# EAGLE design Purpletooth_Jambot (EAGLE 6.4)

## Sheet 1 of 3: Power and data ports
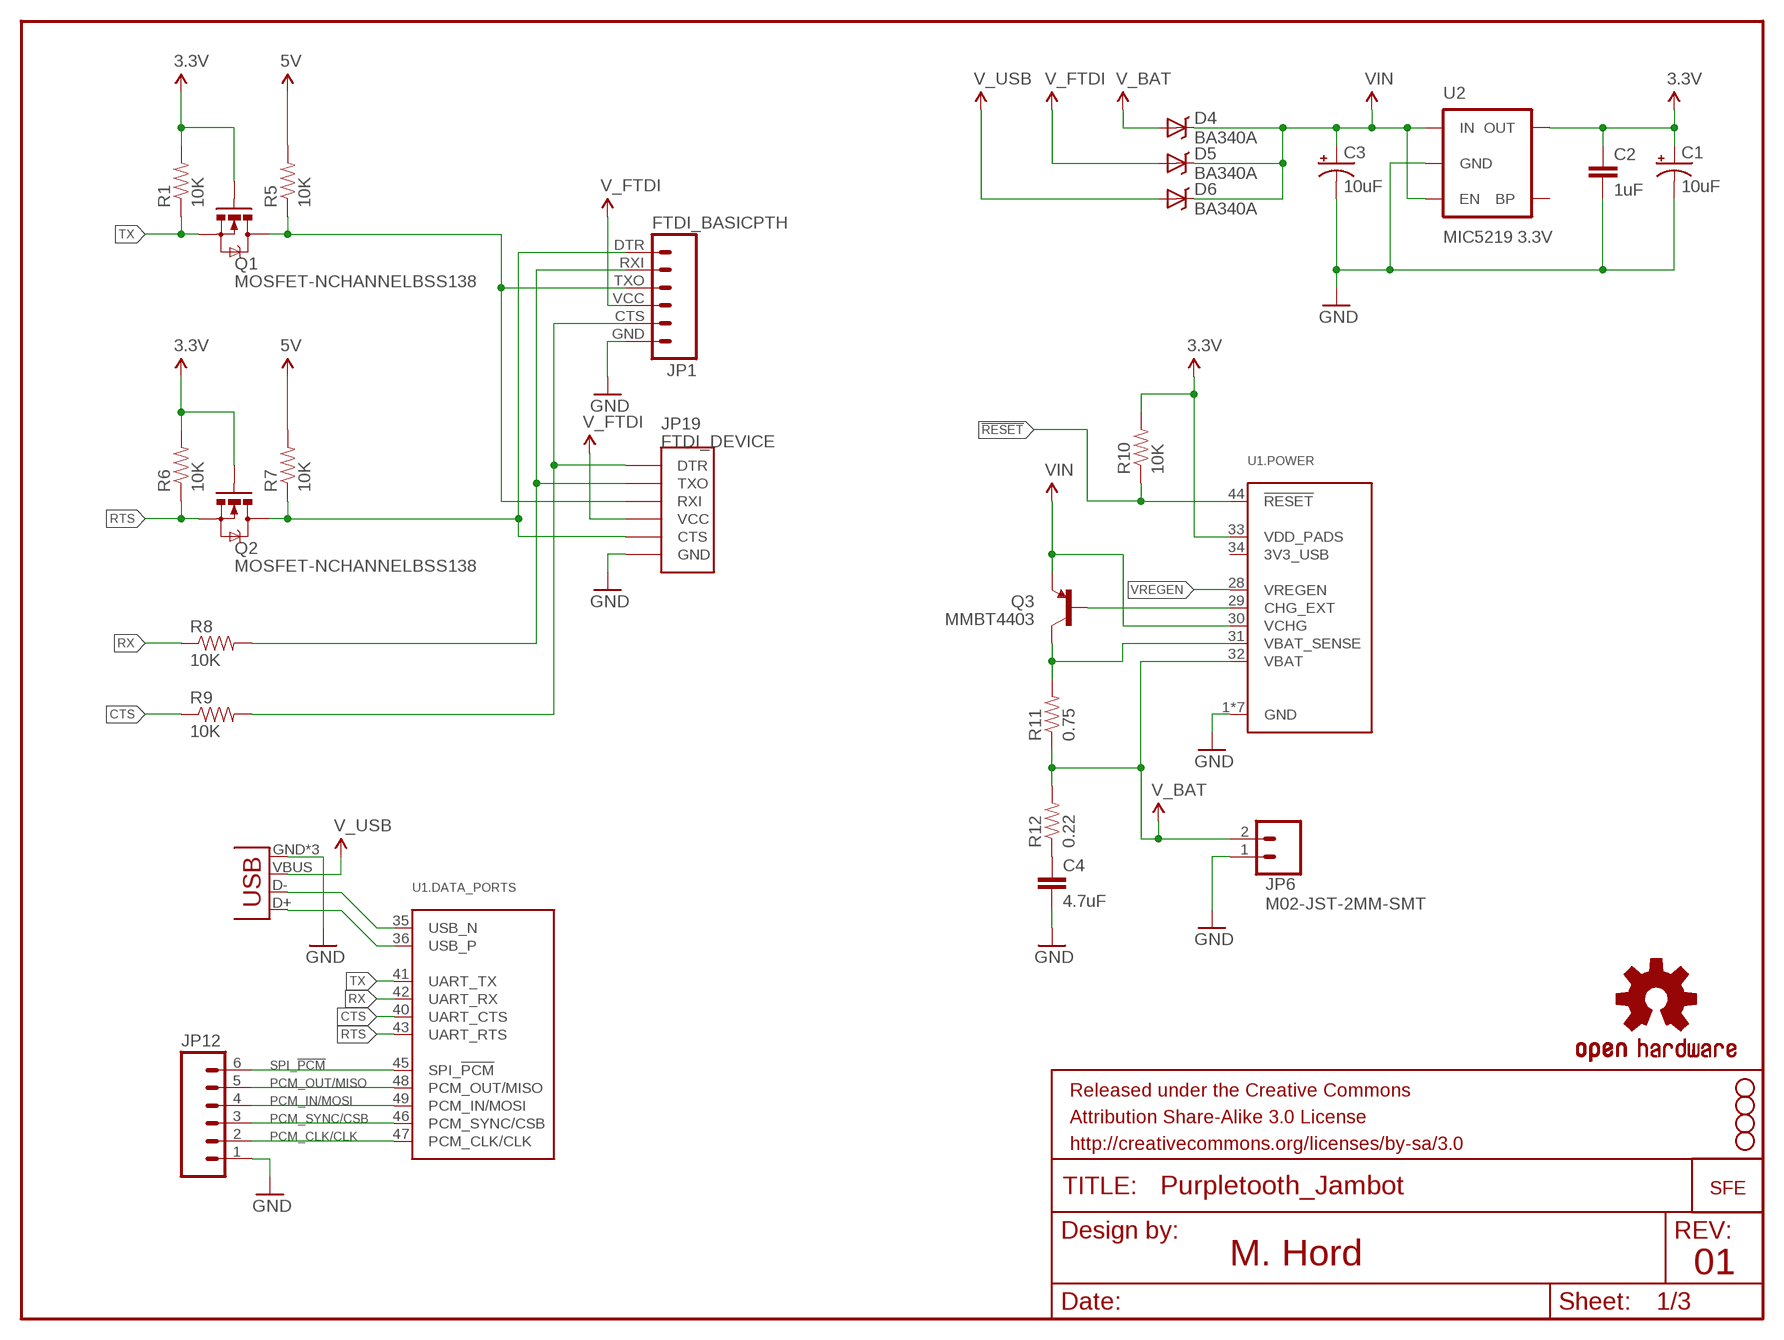
[diagram p0: schematic, sheet 1]

### Parts
C1  10uF  10UF-16V-10%(TANT)  [EIA3216]
C2  1uF  1UF-25V-10%(0805)  [0805]
C3  10uF  10UF-16V-10%(TANT)  [EIA3216]
C4  4.7uF  4.7UF-6.3V-10%(0603)0603  [0603-CAP]
D4  BA340A  B340A  [SMA-DIODE]
D5  BA340A  B340A  [SMA-DIODE]
D6  BA340A  B340A  [SMA-DIODE]
FRAME1  FRAME-LETTER  [CREATIVE_COMMONS]
JP1  FTDI_BASICPTH  [FTDI_BASIC]
JP2  USB-MICROB  [USB-MICROB]
JP6  M02-JST-2MM-SMT  [JST-2-SMD]
JP12  M06SIP  [1X06]
JP19  FTDI_DEVICE  [FTDI_DEVICE_SIDE]
LOGO1  OSHW-LOGOM  [OSHW-LOGO-M]
LOGO2  LOGO-SFENEW  [SFE-NEW-WEBLOGO]
Q1  MOSFET-NCHANNELBSS138  [SOT23]
Q2  MOSFET-NCHANNELBSS138  [SOT23]
Q3  MMBT4403  TRANSISTOR_PNPMMBT4403  [SOT23]
R1  10K  10KOHM1/10W1%(0603)0603  [0603-RES]
R5  10K  10KOHM1/10W1%(0603)0603  [0603-RES]
R6  10K  10KOHM1/10W1%(0603)0603  [0603-RES]
R7  10K  10KOHM1/10W1%(0603)0603  [0603-RES]
R8  10K  10KOHM1/10W1%(0603)0603  [0603-RES]
R9  10K  10KOHM1/10W1%(0603)0603  [0603-RES]
R10  10K  10KOHM1/10W1%(0603)0603  [0603-RES]
R11  0.75  0.75OHM1/4W1%(0805)  [0805]
R12  0.22  0.22OHM1/4W1%(0805)  [0805]
STANDOFF1  STAND-OFF  [STAND-OFF]
STANDOFF2  STAND-OFF  [STAND-OFF]
STANDOFF3  STAND-OFF  [STAND-OFF]
STANDOFF4  STAND-OFF  [STAND-OFF]
U1  BC127  [BC127]
U2  MIC5219 3.3V  V_REG_MIC52193.3V  [SOT23-5]

### Nets
3.3V: C1.A(+) C2.1 Q1.1(G) Q2.1(G) R1.2 R6.2 R10.2 U1.33(.POWER:VDD_PADS) U2.5(OUT) ; also sheet 2,3
5V_CTS: JP1.CTS JP19.P$1(DTR) R9.2
5V_RTS: JP1.DTR JP19.P$5(CTS) Q2.3(D) R7.1
5V_RX: JP1.RXI JP19.P$2(TXO) R8.2
5V_TX: JP1.TXO JP19.P$3(RXI) Q1.3(D) R5.1
!RESET: R10.1 U1.44(.POWER:!RESET)
CHG_EXT: Q3.1(B) U1.29(.POWER:CHG_EXT)
CTS: R9.1 U1.40(.DATA_PORTS:UART_CTS)
GND: C1.C(-) C2.2 C3.C(-) C4.2 JP1.GND JP2.GND JP2.MT1(GND) JP2.MT2(GND) JP6.1 JP12.1 JP19.P$6(GND) U1.1(.POWER:GND) U1.2(.POWER:GND) U1.3(.POWER:GND) U1.4(.POWER:GND) U1.11(.POWER:GND) U1.22(.POWER:GND) U1.27(.POWER:GND) U2.2(GND) ; also sheet 2,3
N$28: C4.1 R12.1
PCM_CLK/CLK: JP12.2 U1.47(.DATA_PORTS:PCM_CLK/CLK)
PCM_IN/MOSI: JP12.4 U1.49(.DATA_PORTS:PCM_IN/MOSI)
PCM_OUT/MISO: JP12.5 U1.48(.DATA_PORTS:PCM_OUT/MISO)
PCM_SYNC/CSB: JP12.3 U1.46(.DATA_PORTS:PCM_SYNC/CSB)
RTS: Q2.2(S) R6.1 U1.43(.DATA_PORTS:UART_RTS)
RX: R8.1 U1.42(.DATA_PORTS:UART_RX)
SPI_!PCM: JP12.6 U1.45(.DATA_PORTS:SPI_!PCM)
TX: Q1.2(S) R1.1 U1.41(.DATA_PORTS:UART_TX)
USB_N: JP2.D- U1.35(.DATA_PORTS:USB_N)
USB_P: JP2.D+ U1.36(.DATA_PORTS:USB_P)
V_BAT: D4.A JP6.2 R11.1 R12.2 U1.32(.POWER:VBAT)
V_FTDI: D5.A JP1.VCC JP19.P$4(VCC)
V_USB: D6.A JP2.VBUS
VBAT_SENSE: Q3.3(C) R11.2 U1.31(.POWER:VBAT_SENSE)
VIN: C3.A(+) D4.C D5.C D6.C Q3.2(E) R5.2 R7.2 U1.30(.POWER:VCHG) U2.1(IN) U2.3(EN) ; supply symbol labelled 5V
VREGEN: U1.28(.POWER:VREGEN) ; also sheet 3
Unconnected: U1.34(.POWER:3V3_USB) U2.4(BP)

### Notes on the sheet
- M. Hord | 01

## Sheet 2 of 3: Analog audio section
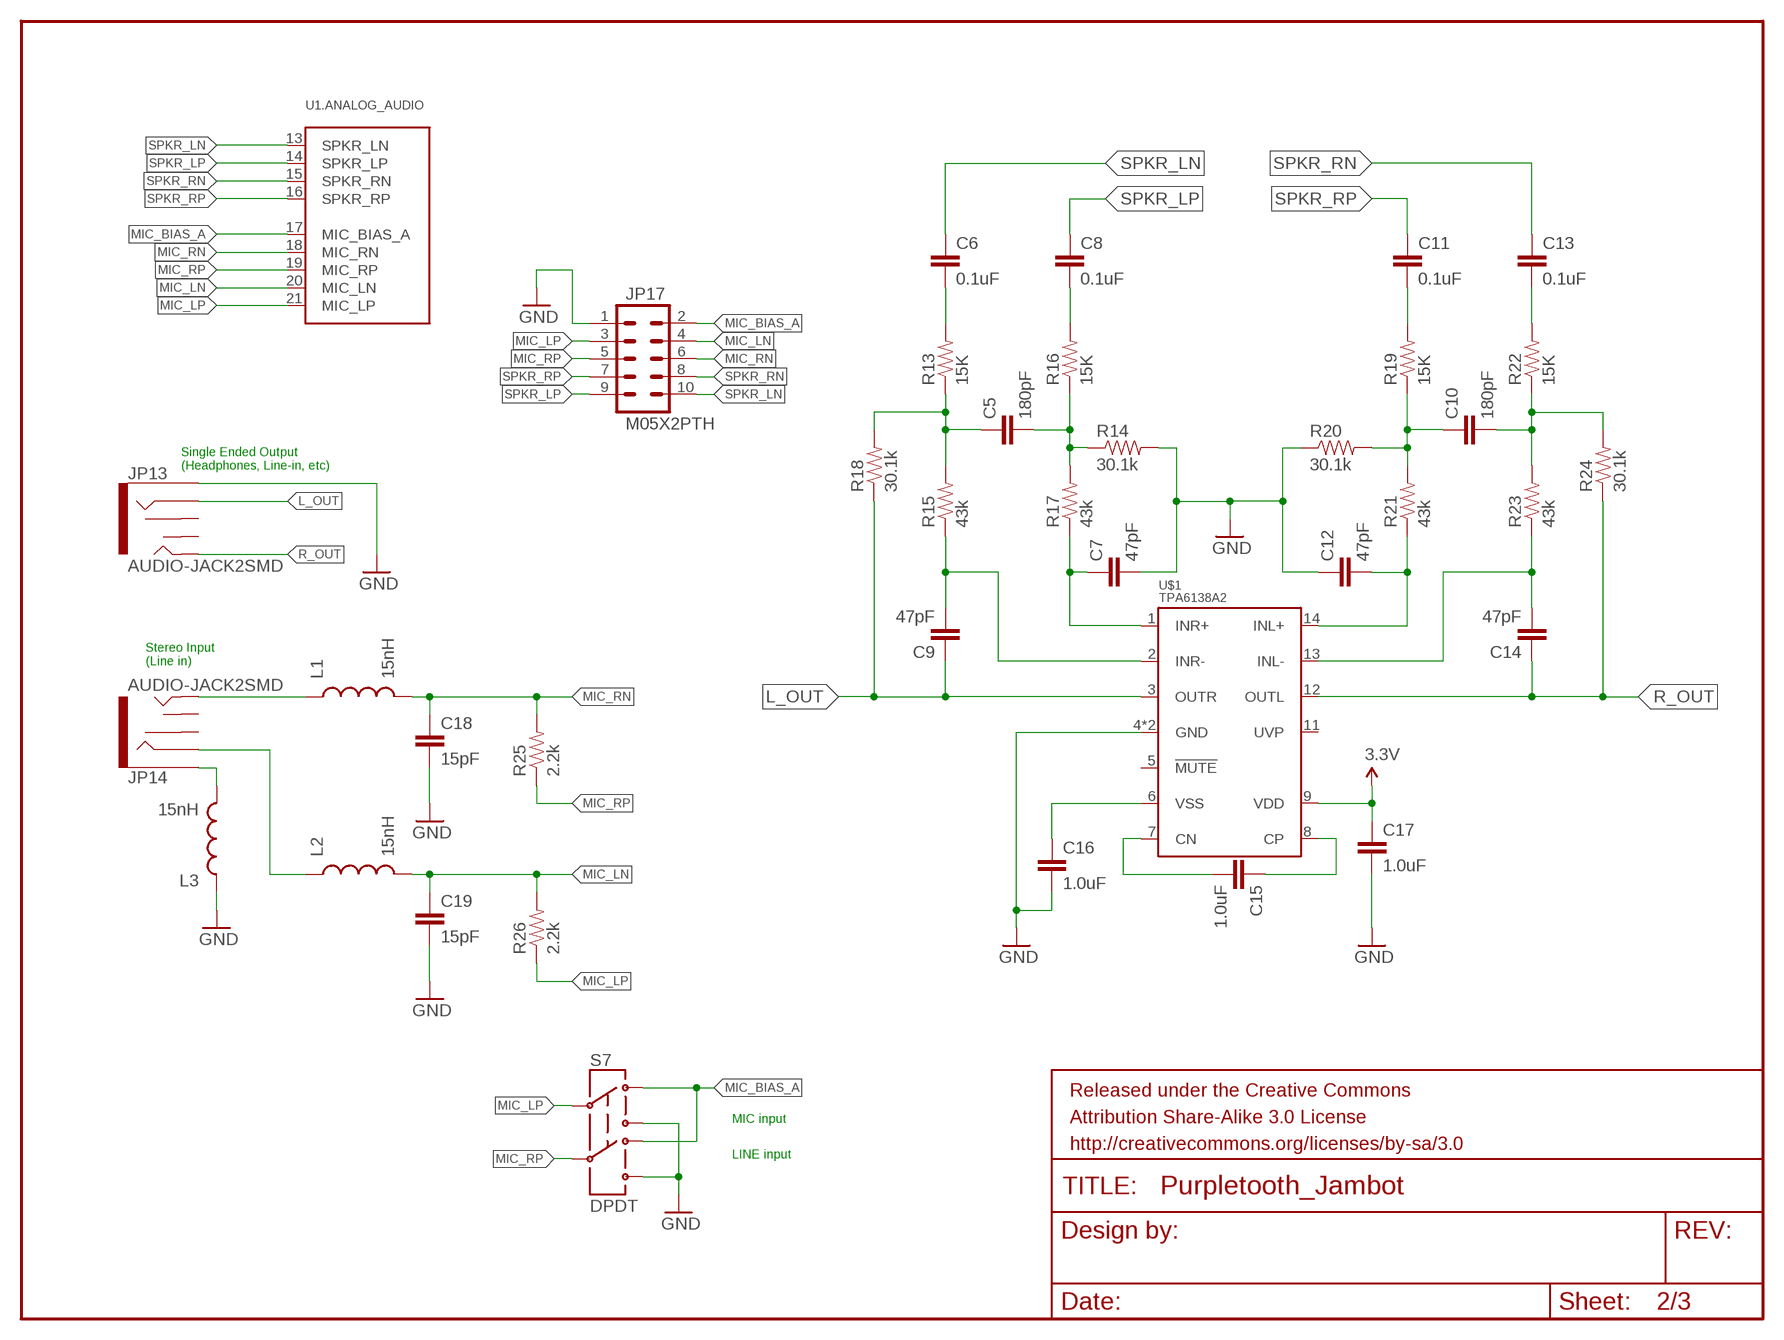
[diagram p1: schematic, sheet 2]

### Parts
C5  180pF  CAP0603-CAP  [0603-CAP]
C6  0.1uF  0.1UF-25V-5%(0603)  [0603-CAP]
C7  47pF  47PF-50V-5%(0603)  [0603-CAP]
C8  0.1uF  0.1UF-25V-5%(0603)  [0603-CAP]
C9  47pF  47PF-50V-5%(0603)  [0603-CAP]
C10  180pF  CAP0603-CAP  [0603-CAP]
C11  0.1uF  0.1UF-25V-5%(0603)  [0603-CAP]
C12  47pF  47PF-50V-5%(0603)  [0603-CAP]
C13  0.1uF  0.1UF-25V-5%(0603)  [0603-CAP]
C14  47pF  47PF-50V-5%(0603)  [0603-CAP]
C15  1.0uF  1.0UF-16V-10%(0603)  [0603-CAP]
C16  1.0uF  1.0UF-16V-10%(0603)  [0603-CAP]
C17  1.0uF  1.0UF-16V-10%(0603)  [0603-CAP]
C18  15pF  15PF-50V-5%(0603)  [0603-CAP]
C19  15pF  15PF-50V-5%(0603)  [0603-CAP]
FRAME2  FRAME-LETTER  [CREATIVE_COMMONS]
JP13  AUDIO-JACK2SMD  [AUDIO-JACK-3.5MM-SMD]
JP14  AUDIO-JACK2SMD  [AUDIO-JACK-3.5MM-SMD]
JP17  M05X2PTH  [AVR_ICSP]
L1  15nH  INDUCTOR0603  [0603]
L2  15nH  INDUCTOR0603  [0603]
L3  15nH  INDUCTOR0603  [0603]
R13  15K  15KOHM1/10W1%(0603)0603  [0603-RES]
R14  30.1k  30.1KOHM1/10W1%(0603)  [0603-RES]
R15  43k  43KOHM1/10W1%(0603)  [0603-RES]
R16  15K  15KOHM1/10W1%(0603)0603  [0603-RES]
R17  43k  43KOHM1/10W1%(0603)  [0603-RES]
R18  30.1k  30.1KOHM1/10W1%(0603)  [0603-RES]
R19  15K  15KOHM1/10W1%(0603)0603  [0603-RES]
R20  30.1k  30.1KOHM1/10W1%(0603)  [0603-RES]
R21  43k  43KOHM1/10W1%(0603)  [0603-RES]
R22  15K  15KOHM1/10W1%(0603)0603  [0603-RES]
R23  43k  43KOHM1/10W1%(0603)  [0603-RES]
R24  30.1k  30.1KOHM1/10W1%(0603)  [0603-RES]
R25  2.2k  2.2KOHM1/10W1%(0603)  [0603-RES]
R26  2.2k  2.2KOHM1/10W1%(0603)  [0603-RES]
S7  DPDT  SWITCH-DPDTAYZ0202  [AYZ0202]
U$1  TPA6138A2  [TSSOP-14]

### Nets
3.3V: C17.1 U$1.9(VDD) ; also sheet 1,3
GND: C7.2 C12.1 C16.2 C17.2 C18.2 C19.2 JP13.SLEEVE JP17.1 L3.1 R14.2 R20.1 S7.3 S7.6 U$1.4(GND) U$1.10(GND) ; also sheet 1,3
L_OUT: C9.1 JP13.RING R18.1 U$1.3(OUTR)
MIC_BIAS_A: JP17.2 S7.1 S7.4 U1.17(.ANALOG_AUDIO:MIC_BIAS_A)
MIC_LN: C19.1 JP17.4 L2.2 R26.2 U1.20(.ANALOG_AUDIO:MIC_LN)
MIC_LP: JP17.3 R26.1 S7.2 U1.21(.ANALOG_AUDIO:MIC_LP)
MIC_RN: C18.1 JP17.6 L1.2 R25.2 U1.18(.ANALOG_AUDIO:MIC_RN)
MIC_RP: JP17.5 R25.1 S7.5 U1.19(.ANALOG_AUDIO:MIC_RP)
N$1: JP14.SLEEVE L3.2
N$4: C8.2 R16.2
N$5: C6.2 R13.2
N$8: C5.1 R13.1 R15.2 R18.2
N$9: C9.2 R15.1 U$1.2(INR-)
N$12: C7.1 R17.1 U$1.1(INR+)
N$13: C5.2 R14.1 R16.1 R17.2
N$15: JP14.TIP L1.1
N$16: C10.1 R19.1 R20.2 R21.2
N$17: C12.2 R21.1 U$1.14(INL+)
N$18: C11.2 R19.2
N$19: C10.2 R22.1 R23.2 R24.2
N$20: C13.2 R22.2
N$21: C14.2 R23.1 U$1.13(INL-)
N$22: JP14.RING L2.1
N$24: C16.1 U$1.6(VSS)
N$25: C15.2 U$1.7(CN)
N$26: C15.1 U$1.8(CP)
R_OUT: C14.1 JP13.TIP R24.1 U$1.12(OUTL)
SPKR_LN: C6.1 JP17.10 U1.13(.ANALOG_AUDIO:SPKR_LN)
SPKR_LP: C8.1 JP17.9 U1.14(.ANALOG_AUDIO:SPKR_LP)
SPKR_RN: C13.1 JP17.8 U1.15(.ANALOG_AUDIO:SPKR_RN)
SPKR_RP: C11.1 JP17.7 U1.16(.ANALOG_AUDIO:SPKR_RP)
Unconnected: JP13.RSH JP13.TSH JP14.RSH JP14.TSH U$1.5(!MUTE) U$1.11(UVP)

### Notes on the sheet
- Single Ended Output
  (Headphones, Line-in, etc)
- Stereo Input
  (Line in)
- MIC input
- LINE input

## Sheet 3 of 3: Digital I/O signals
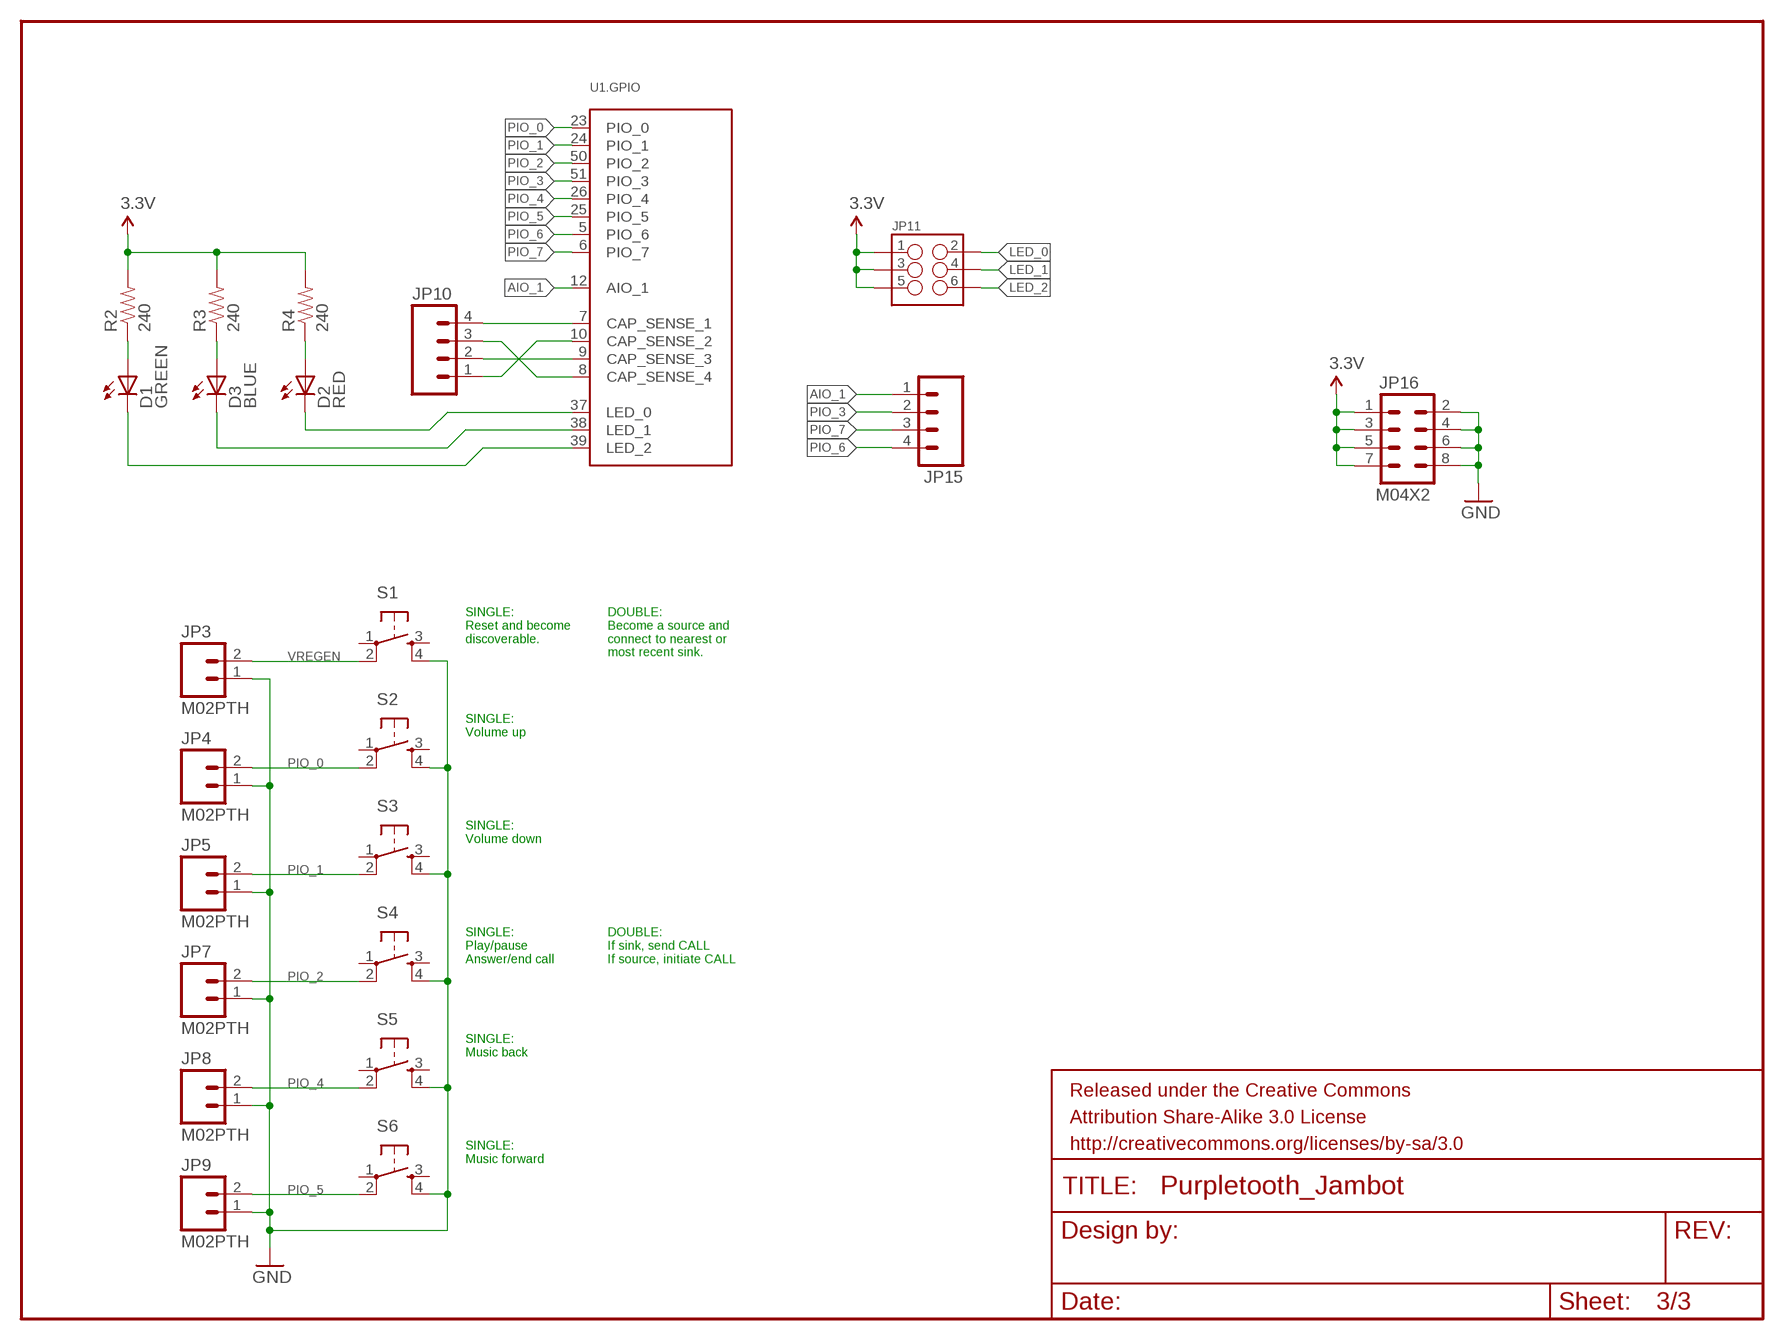
[diagram p2: schematic, sheet 3]

### Parts
D1  GREEN  LED-GREEN0603  [LED-0603]
D2  RED  LED-RED0603  [LED-0603]
D3  BLUE  LED-BLUE0603  [LED-0603]
FRAME3  FRAME-LETTER  [CREATIVE_COMMONS]
JP3  M02PTH  [1X02]
JP4  M02PTH  [1X02]
JP5  M02PTH  [1X02]
JP7  M02PTH  [1X02]
JP8  M02PTH  [1X02]
JP9  M02PTH  [1X02]
JP10  M04PTH  [1X04]
JP11  M03X22X3_SILK_SM  [2X3]
JP15  M04PTH  [1X04]
JP16  M04X2  [2X4]
R2  240  240OHM1/10W1%(0603)  [0603-RES]
R3  240  240OHM1/10W1%(0603)  [0603-RES]
R4  240  240OHM1/10W1%(0603)  [0603-RES]
S1  TAC_SWITCHSMD  [TACTILE_SWITCH_SMD]
S2  TAC_SWITCHSMD  [TACTILE_SWITCH_SMD]
S3  TAC_SWITCHSMD  [TACTILE_SWITCH_SMD]
S4  TAC_SWITCHSMD  [TACTILE_SWITCH_SMD]
S5  TAC_SWITCHSMD  [TACTILE_SWITCH_SMD]
S6  TAC_SWITCHSMD  [TACTILE_SWITCH_SMD]

### Nets
3.3V: JP11.1 JP11.3 JP11.5 JP16.1 JP16.3 JP16.5 JP16.7 R2.2 R3.2 R4.2 ; also sheet 1,2
AIO_1: JP15.1 U1.12(.GPIO:AIO_1)
CAP_SENSE-4: JP10.3 U1.8(.GPIO:CAP_SENSE_4)
CAP_SENSE_1: JP10.4 U1.7(.GPIO:CAP_SENSE_1)
CAP_SENSE_2: JP10.1 U1.10(.GPIO:CAP_SENSE_2)
CAP_SENSE_3: JP10.2 U1.9(.GPIO:CAP_SENSE_3)
GND: JP3.1 JP4.1 JP5.1 JP7.1 JP8.1 JP9.1 JP16.2 JP16.4 JP16.6 JP16.8 S1.4 S2.4 S3.4 S4.4 S5.4 S6.4 ; also sheet 1,2
LED_0: D2.C JP11.2 U1.37(.GPIO:LED_0)
LED_1: D3.C JP11.4 U1.38(.GPIO:LED_1)
LED_2: D1.C JP11.6 U1.39(.GPIO:LED_2)
N$2: D3.A R3.1
N$6: D2.A R4.1
N$7: D1.A R2.1
PIO_0: JP4.2 S2.2 U1.23(.GPIO:PIO_0)
PIO_1: JP5.2 S3.2 U1.24(.GPIO:PIO_1)
PIO_2: JP7.2 S4.2 U1.50(.GPIO:PIO_2)
PIO_3: JP15.2 U1.51(.GPIO:PIO_3)
PIO_4: JP8.2 S5.2 U1.26(.GPIO:PIO_4)
PIO_5: JP9.2 S6.2 U1.25(.GPIO:PIO_5)
PIO_6: JP15.4 U1.5(.GPIO:PIO_6)
PIO_7: JP15.3 U1.6(.GPIO:PIO_7)
VREGEN: JP3.2 S1.2 ; also sheet 1
Unconnected: S1.1 S1.3 S2.1 S2.3 S3.1 S3.3 S4.1 S4.3 S5.1 S5.3 S6.1 S6.3

### Notes on the sheet
- SINGLE:
  Reset and become
  discoverable.
- DOUBLE:
  Become a source and
  connect to nearest or
  most recent sink.
- SINGLE:
  Volume up
- SINGLE:
  Volume down
- SINGLE:
  Play/pause
  Answer/end call
- DOUBLE:
  If sink, send CALL
  If source, initiate CALL
- SINGLE:
  Music back
- SINGLE:
  Music forward

## Library data of the parts
C1 C3 = SparkFun-Capacitors:10UF-16V-10%(TANT): CAP-00811 1206/EIA-3216 Tantalum capacitor; PROD_ID: CAP-00811
C2 = SparkFun-Capacitors:1UF-25V-10%(0805): CAP-08064; PROD_ID: CAP-08064
C4 = SparkFun-Capacitors:4.7UF-6.3V-10%(0603): CAP-08280; PROD_ID: CAP-08280
C5 C10 = SparkFun-Capacitors:CAP: Capacitor Standard 0603 ceramic capacitor, and 0.1" leaded capacitor.; DIST: Digikey; DIST_ID: 1276-1255-2-ND
C6 C8 C11 C13 = SparkFun-Capacitors:0.1UF-25V-5%(0603): CAP-08604; PROD_ID: CAP-08604
C7 C9 C12 C14 = SparkFun-Capacitors:47PF-50V-5%(0603): CAP-08913; PROD_ID: CAP-08913
C15-C17 = SparkFun-Capacitors:1.0UF-16V-10%(0603): CAP-00868; PROD_ID: CAP-00868
C18 C19 = SparkFun-Capacitors:15PF-50V-5%(0603): CAP-07881; PROD_ID: CAP-07881
D1 = SparkFun-LED:LED-GREEN: Various green LEDs 0603- DIO-00821 LARGE- DIO-00862 LILYPAD- DIO-09910; PROD_ID: DIO-00821
D2 = SparkFun-LED:LED-RED: Assorted Red LEDs LilyPad 1206- DIO-09912 1206- DIO-00809 0603- DIO-00819; PROD_ID: DIO-00819
D3 = SparkFun-LED:LED-BLUE: Blue LEDs for production use Various blue LEDs stocked by SparkFun production 0603 - DIO-08575 Rebel - DIO-09553 1206 - DIO-09911; PROD_ID: DIO-08575
D4-D6 = SparkFun-DiscreteSemi:B340A: Schottky Diode 3A-40V; PROD_ID: DIO-09886
FRAME1-FRAME3 = SparkFun-Aesthetics:FRAME-LETTER: Schematic Frame Standard 8.5x11 US Letter frame
JP1 = SparkFun-Connectors:FTDI_BASIC: FTDI Basic header with labels
JP2 = SparkFun-Connectors:USB: USB Connectors USB-B-PTH is fully proven SKU : PRT-00139/CONN-08278 USB-miniB is fully proven SKU : PRT-00587 USB-A-PCB is untested. USB-A-H is throughly reviewed, but untested. Spark Fun Electronics SKU : PRT-00437 USB-B-SMT is throughly reviewed, but untested. Needs silkscreen touching up. USB-A-S has not been used/tested USB-MB-H has not been used/tested USB-MICROB has been used. CONN-09505; PROD_ID: CONN-09505
JP3-JP5 JP7-JP9 = SparkFun-Connectors:M02: Standard 2-pin 0.1" header. Use with - straight break away headers ( PRT-00116) - right angle break away headers (PRT-00553) - swiss pins (PRT-00743) - machine pins (PRT-00117) - female headers (PRT-00115) Molex polarized connector foot print use with: PRT-08233 with associated crimp pins and housings. 2.54_SCREWTERM for use with PRT-10571. 3.5mm Screw Terminal footprints for PRT-08084 5mm Screw Terminal footprints for use with PRT-08433
JP6 = SparkFun-Connectors:M02: Standard 2-pin 0.1" header. Use with - straight break away headers ( PRT-00116) - right angle break away headers (PRT-00553) - swiss pins (PRT-00743) - machine pins (PRT-00117) - female headers (PRT-00115) Molex polarized connector foot print use with: PRT-08233 with associated crimp pins and housings. 2.54_SCREWTERM for use with PRT-10571. 3.5mm Screw Terminal footprints for PRT-08084 5mm Screw Terminal footprints for use with PRT-08433; PROD_ID: CONN-08352
JP10 JP15 = SparkFun-Connectors:M04: Header 4 Standard 4-pin 0.1" header. Use with straight break away headers (SKU : PRT-00116), right angle break away headers (PRT-00553), swiss pins (PRT-00743), machine pins (PRT-00117), and female headers (PRT-00115). Molex polarized connector foot print use with SKU : PRT-08231 with associated crimp pins and housings. 1MM SMD Version SKU: PRT-10208
JP11 = SparkFun-Connectors:M03X2: 2x3 .1" header. Shrouded, with keying- CONN-10681 SMT- CONN-11415 Pogo pins- HW-11044
JP12 = SparkFun-Connectors:M06: Header 6 Standard 6-pin 0.1" header. Use with straight break away headers (SKU : PRT-00116), right angle break away headers (PRT-00553), swiss pins (PRT-00743), machine pins (PRT-00117), and female headers (PRT-00115). Molex polarized connector foot print use with SKU : PRT-08094 with associated crimp pins and housings. NOTES ON THE VARIANTS LOCK and LOCK_LONGPADS... This footprint was designed to help hold the alignment of a through-hole component (i.e. 6-pin header) while soldering it into place. You may notice that each hole has been shifted either up or down by 0.005 of an inch from it's more standard position (which is a perfectly straight line). This slight alteration caused the pins (the squares in the middle) to touch the edges of the holes. Because they are alternating, it causes a "brace" to hold the component in place. 0.005 has proven to be the perfect amount of "off-center" position when using our standard breakaway headers. Although looks a little odd when you look at the bare footprint, once you have a header in there, the alteration is very hard to notice. Also,if you push a header all the way into place, it is covered up entirely on the bottom side. This idea of altering the position of holes to aid alignment will be further integrated into the Sparkfun Library for other footprints. It can help hold any component with 3 or more connection pins.
JP13 JP14 = SparkFun-Connectors:AUDIO-JACK2: Stereo audio jack with bypass switches. Used on LilyPad MP3 board. Production SKU: CONN-10353; PROD_ID: CONN-10353
JP16 = SparkFun-Connectors:M04X2: .1" header, two rows of four.
JP17 = SparkFun-Connectors:M05X2: Header 5x2 Standard 10-pin dual row 0.1" header. Commonly used with AVR-ISP. Use with Spark Fun Electronics SKU: PRT-00778
JP19 = SparkFun-Connectors:FTDI_DEVICE: Connector which mates to FTDI basic or FTDI cable.
L1-L3 = SparkFun-Passives:INDUCTOR: Inductors Basic Inductor/Choke - 0603 and 1206. Footprints are not proven and vary greatly between part numbers.; DIST: DIGIKEY; DIST_ID: 535-11527-1-ND
LOGO1 = SparkFun-Aesthetics:OSHW-LOGO: Open Source Hardware Logo This logo indicates the piece of hardware it is found on incorporates a OSHW license and/or adheres to the definition of open source hardware found here: http://freedomdefined.org/OSHW
LOGO2 = SparkFun-Aesthetics:LOGO-SFE: Spark Fun Electronics PCB Logo This is the standard Spark Fun Electronics PCB logo.
Q1 Q2 = SparkFun-DiscreteSemi:MOSFET-NCHANNEL: Common NMOSFET Parts MFG P/N Store ID Prod ID FDD8780 TRANS-09984 SI7820DN TRANS-11055 FDS6630A IC-08089 2N7002PW TRANS-11151 FQP30N06L COM-10213 TRANS-10060 BSS123LT1G TRANS-08345 BSS138 TRANS-00830 BS170 2N7000; PROD_ID: TRANS-00830
Q3 = SparkFun-DiscreteSemi:TRANSISTOR_PNP: Generic PNP BJT Double check pinouts against datasheets- not all devices are the same! MMBT3906 - 40V 200mA SOT-23 (TRANS-08052) MMBT4403 - 40V 600mA SOT-23 (TRANS-09245); PROD_ID: TRANS-09245
R1 R5-R10 = SparkFun-Resistors:10KOHM1/10W1%(0603): RES-00824; PROD_ID: RES-00824
R2-R4 = SparkFun-Resistors:240OHM1/10W1%(0603): RES-07849; PROD_ID: RES-07849
R11 = SparkFun-Resistors:0.75OHM1/4W1%(0805): RES-08474; PROD_ID: RES-08474
R12 = SparkFun-Resistors:0.22OHM1/4W1%(0805): RES-09883; PROD_ID: RES-09883
R13 R16 R19 R22 = SparkFun-Resistors:15KOHM1/10W1%(0603): RES-07854; PROD_ID: RES-07854
R14 R18 R20 R24 = SparkFun-Resistors:30.1KOHM1/10W1%(0603): RES-08595; PROD_ID: RES-08595
R15 R17 R21 R23 = SparkFun-Resistors:43KOHM1/10W1%(0603): RES-07858; PROD_ID: RES-07858
R25 R26 = SparkFun-Resistors:2.2KOHM1/10W1%(0603): RES-08272; PROD_ID: RES-08272
S1-S6 = SparkFun-Electromechanical:TAC_SWITCH: Momentary Switch Button commonly used for reset or general input. Spark Fun Electronics SKU : COM-00097 SMT- SWCH-08247; PROD_ID: SWCH-08247
S7 = SparkFun-Electromechanical:SWITCH-DPDT: DPDT Version of the COM-00597; PROD_ID: SWCH-08179
STANDOFF1-STANDOFF4 = SparkFun-Electromechanical:STAND-OFF: #4 Stand Off This is the mechanical footprint for a #4 phillips button head screw. Use the keepout ring to avoid running the screw head into surrounding components. SKU : PRT-00447
U1 = SparkFun-RF:BC127: Blue Creations BC127 BLE module Hyper-competent Bluetooth 4.0 module, with: - Pre-4.0 support - 4 Cap sense inputs - 1 Analog input - 8 GPIO - 3 Open-drain LED drivers - Onboard battery charge circuitry - SPP/UART support - PCM Audio support - SPI port - Built-in USB - All kinds of other crazy crap; PROD_ID: xxx; VALUE: BC127
U2 = SparkFun-PowerIC:V_REG_MIC5219: V_REG MIC5219 Standard 500mA LDO voltage regulator in SOT-23 layout. Micrel part MIC5219. BP (by-pass) pin is used to lower output noise with 470pF cap, may be left open.; PROD_ID: VREG-09872
U$1 = SparkFun-AnalogIC:TPA6138A2: Headphone driver amp Differential to single-ended audio amplifier.

## Board
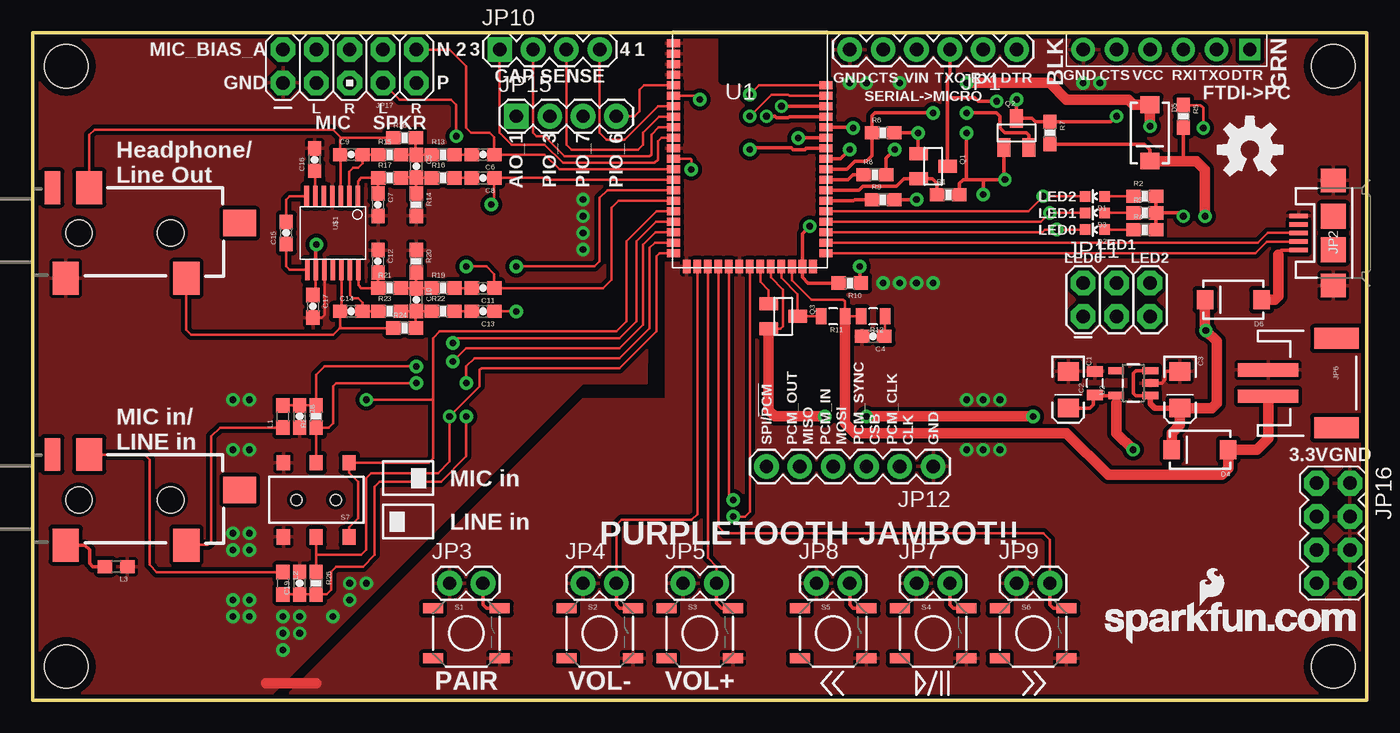
[diagram p3: board, top side]
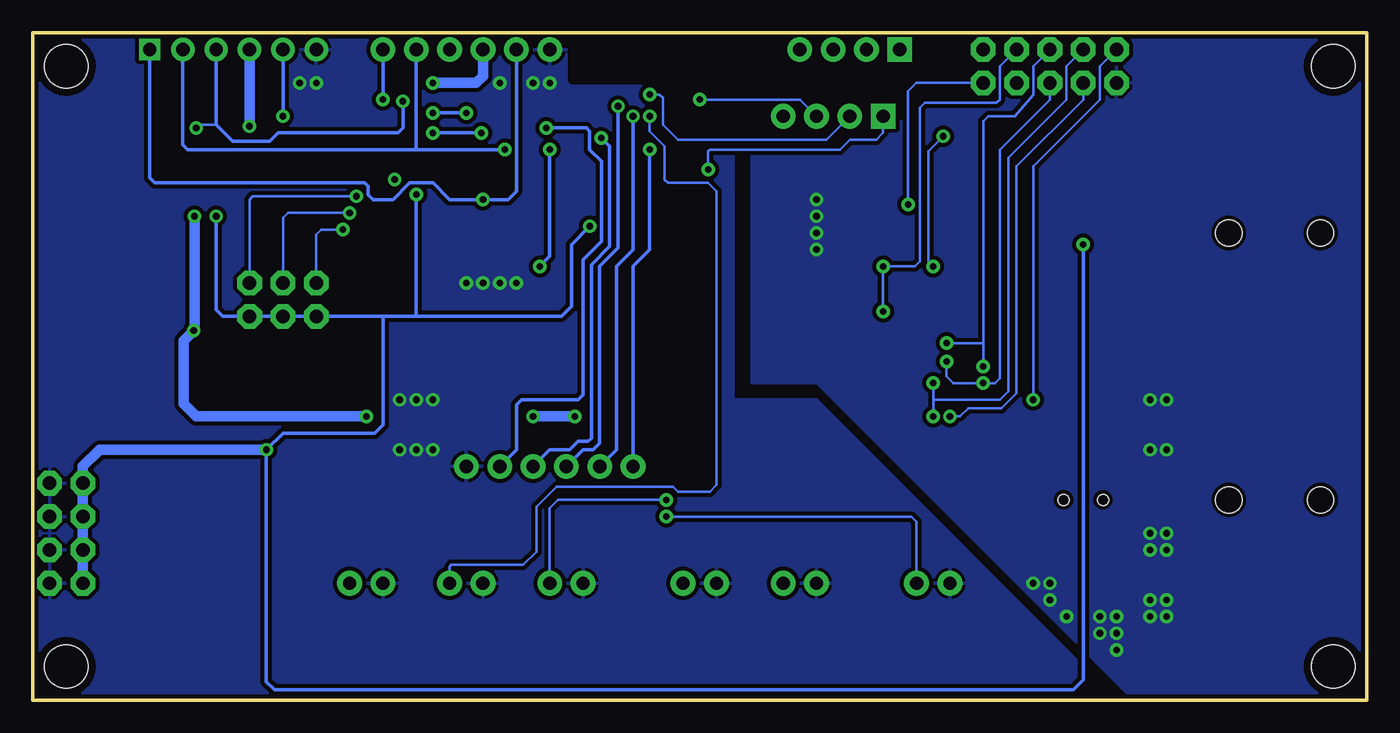
[diagram p4: board, bottom side, seen from below]

Size 101.6 x 50.8 mm. Coordinates in mm from the lower left corner, seen from the top.
Outline: 0,0 101.6,0 101.6,50.8 0,50.8 0,0
Copper layers (1*16): Top 0.035mm / dielectric 1.5mm / Bottom 0.035mm
Design rules "Sparkfun": minimum track width 8mil, minimum drill 20mil, track to track 8mil, track to pad 8mil, pad to pad 8mil, via to via 8mil, smd to smd 8mil, copper to edge 8mil, drill to drill 8mil, minimum pad ring 12mil, minimum via ring 10mil, stop-mask expansion 4mil, vias tented up to drill 20mil, thermal gap 10mil

### Footprints (pad centres in the part's own frame; a part is rotated, then mirrored left to right if it is on the bottom)
EIA3216 = smd 1.4 x 1.6: A 1.4,0; C -1.4,0
0805 = smd 0.8 x 1.2: 1 -0.9,0; 2 0.9,0
0603-CAP = smd 1.1 x 1: 1 -0.85,0; 2 0.85,0
LED-0603 = smd 0.8 x 0.8: A 0,-0.75; C 0,0.75
SMA-DIODE = smd 1.27 x 1.47: A -2.15,0; C 2.15,0
FTDI_BASIC = drill 1.016 pad 1.88: CTS 10.16,0; DTR 0,0; GND 12.7,0; RXI 2.54,0; TXO 5.08,0; VCC 7.62,0
USB-MICROB = smd 0.35 x 1.4: D+ 0,2.65; D- -0.65,2.65; GND 1.3,2.65; ID 0.65,2.65; VBUS -1.3,2.65 | smd 1.8 x 1.9: MT1 -4,0; MT2 4,0 | smd 1.9 x 1.9: P$1 -1.27,0; P$2 1.27,0
1X02 = drill 1.016 pad 1.88: 1 0,0; 2 2.54,0
JST-2-SMD = smd 1 x 4.6: 1 -1,-3.7; 2 1,-3.7 | smd 1.6 x 3.4: NC1 -3.4,1.5; NC2 3.4,1.5
1X04 = drill 1.016 pad 1.88 square: 1 0,0 | drill 1.016 pad 1.88: 2 2.54,0; 3 5.08,0; 4 7.62,0
2X3 = drill 1.016 pad 1.88 octagon: 1 0,0; 2 0,2.54; 3 2.54,0; 4 2.54,2.54; 5 5.08,0; 6 5.08,2.54
1X06 = drill 1.016 pad 1.88: 1 0,0; 2 2.54,0; 3 5.08,0; 4 7.62,0; 5 10.16,0; 6 12.7,0
AUDIO-JACK-3.5MM-SMD = smd 2 x 2.5: RING 4.3,3.45; SLEEVE 2.5,-3.45; TIP 11.7,-3.45 | smd 1.2 x 2.5: RSH 1.5,3.45 | smd 2.5 x 2: TSH 15.75,0.75 | hole 2: 3.5,0; 10.5,0
2X4 = drill 1.016 pad 1.88 octagon: 1 -3.81,-1.27; 2 -3.81,1.27; 3 -1.27,-1.27; 4 -1.27,1.27; 5 1.27,-1.27; 6 1.27,1.27; 7 3.81,-1.27; 8 3.81,1.27
AVR_ICSP = drill 1.016 pad 1.88 octagon: 1 -1.27,5.08; 2 1.27,5.08; 3 -1.27,2.54; 4 1.27,2.54; 5 -1.27,0; 6 1.27,0; 7 -1.27,-2.54; 8 1.27,-2.54; 9 -1.27,-5.08; 10 1.27,-5.08
FTDI_DEVICE_SIDE = drill 1 square: P$1 -6.35,0 | drill 1.016 pad 1.778: P$2 -3.81,0; P$3 -1.27,0; P$4 1.27,0; P$5 3.81,0; P$6 6.35,0
0603 = smd 1.1 x 1: 1 -0.85,0; 2 0.85,0
SOT23 = smd 1 x 1.4: 1 -0.95,-1.1; 2 0.95,-1.1; 3 0,1.1
0603-RES = smd 1.1 x 1: 1 -0.85,0; 2 0.85,0
TACTILE_SWITCH_SMD = smd 1.524 x 0.762: 1 -2.54,1.905; 2 2.54,1.905; 3 -2.54,-1.905; 4 2.54,-1.905
AYZ0202 = smd 1 x 1.15: 1 -2.5,2.825; 2 0,2.825; 3 2.5,2.825; 4 -2.5,-2.825; 5 0,-2.825; 6 2.5,-2.825 | hole 0.85: 1.5,0; -1.5,0
STAND-OFF = hole 3.302: 0,0
BC127 = smd 1 x 0.6: 1 -5.8,8.1; 2 -5.8,7.3; 3 -5.8,6.5; 4 -5.8,5.7; 5 -5.8,4.9; 6 -5.8,4.1; 7 -5.8,3.3; 8 -5.8,2.5; 9 -5.8,1.7; 10 -5.8,0.9; 11 -5.8,0.1; 12 -5.8,-0.7; 13 -5.8,-1.5; 14 -5.8,-2.3; 15 -5.8,-3.1; 16 -5.8,-3.9; 17 -5.8,-4.7; 18 -5.8,-5.5; 19 -5.8,-6.3; 20 -5.8,-7.1; 21 -5.8,-7.9; 35 5.8,-7.9; 36 5.8,-7.1; 37 5.8,-6.3; 38 5.8,-5.5; 39 5.8,-4.7; 40 5.8,-3.9; 41 5.8,-3.1; 42 5.8,-2.3; 43 5.8,-1.5; 44 5.8,-0.7; 45 5.8,0.1; 46 5.8,0.9; 47 5.8,1.7; 48 5.8,2.5; 49 5.8,3.3; 50 5.8,4.1; 51 5.8,4.9 | smd 0.6 x 1: 22 -4.8,-8.9; 23 -4,-8.9; 24 -3.2,-8.9; 25 -2.4,-8.9; 26 -1.6,-8.9; 27 -0.8,-8.9; 28 0,-8.9; 29 0.8,-8.9; 30 1.6,-8.9; 31 2.4,-8.9; 32 3.2,-8.9; 33 4,-8.9; 34 4.8,-8.9
SOT23-5 = smd 0.55 x 1.2: 1 -0.95,-1.3; 2 0,-1.3; 3 0.95,-1.3; 4 0.95,1.3; 5 -0.95,1.3
TSSOP-14 = smd 1.6 x 0.35: 1 -2.8,1.9; 2 -2.8,1.25; 3 -2.8,0.6; 4 -2.8,-0.05; 5 -2.8,-0.7; 6 -2.8,-1.35; 7 -2.8,-2; 8 2.8,-1.95; 9 2.8,-1.3; 10 2.8,-0.65; 11 2.8,0; 12 2.8,0.65; 13 2.8,1.3; 14 2.8,1.95

### Placement (x,y rotation side)
C1  78.87,23.62 270 top
C2  80.9,24.13 90 top
C3  87.38,23.62 270 top
C4  64.01,27.69 180 top
C5  29.21,40.64 270 top
C6  34.29,41.53 180 top
C7  26.29,37.72 270 top
C8  34.29,39.75 180 top
C9  24.26,41.53 0 top
C10  29.21,30.48 270 top
C11  34.29,31.37 180 top
C12  26.29,33.4 270 top
C13  34.29,29.59 180 top
C14  24.26,29.59 0 top
C15  19.3,35.56 90 top
C16  21.46,41.15 90 top
C17  21.34,29.97 270 top
C18  20.32,21.59 270 top
C19  20.32,8.89 90 top
D1  80.9,38.35 90 top
D2  80.9,35.81 90 top
D3  80.9,37.08 90 top
D4  88.9,19.05 180 top
D5  85.09,43.18 270 top
D6  91.44,30.48 180 top
FRAME1  180.34,19.05 0 top  (outside the outline)
FRAME2  -19.05,-35.56 0 top  (outside the outline)
FRAME3  -66.04,146.05 0 top  (outside the outline)
JP1  74.93,49.53 180 top
JP2  99.06,35.56 90 top
JP3  31.75,8.89 0 top
JP4  41.91,8.89 0 top
JP5  49.53,8.89 0 top
JP6  97.79,24.13 270 top
JP7  67.31,8.89 0 top
JP8  59.69,8.89 0 top
JP9  74.93,8.89 0 top
JP10  35.56,49.53 0 top
JP11  80.01,29.21 0 top
JP12  68.58,17.78 180 top
JP13  0,35.56 0 top
JP14  0,15.24 0 top
JP15  36.83,44.45 0 top
JP16  99.06,12.7 270 top
JP17  24.13,48.26 90 top
JP19  86.36,49.53 180 top
L1  19.05,21.59 90 top
L2  19.05,8.89 270 top
L3  6.35,10.16 180 top
LOGO1  92.71,41.91 0 top
LOGO2  81.66,4.32 0 top
Q1  68.58,40.64 270 top
Q2  74.93,43.18 0 top
Q3  57.15,29.21 270 top
R1  69.72,38.48 0 top
R2  84.71,38.35 0 top
R3  84.71,37.08 0 top
R4  84.71,35.81 0 top
R5  87.63,44.45 270 top
R6  64.77,43.18 0 top
R7  77.47,43.18 270 top
R8  64.14,40.01 0 top
R9  64.77,38.1 0 top
R10  62.23,31.75 180 top
R11  60.96,29.21 180 top
R12  64.01,29.21 180 top
R13  31.24,41.53 0 top
R14  29.21,37.72 270 top
R15  27.18,41.53 0 top
R16  31.24,39.75 0 top
R17  27.18,39.75 0 top
R18  28.32,42.8 0 top
R19  31.24,31.37 0 top
R20  29.21,33.4 270 top
R21  27.18,31.37 0 top
R22  31.24,29.59 0 top
R23  27.18,29.59 0 top
R24  28.32,28.32 0 top
R25  21.59,21.59 90 top
R26  21.59,8.89 270 top
S1  33.02,5.08 0 top
S2  43.18,5.08 0 top
S3  50.8,5.08 0 top
S4  68.58,5.08 0 top
S5  60.96,5.08 0 top
S6  76.2,5.08 0 top
S7  21.59,15.24 180 top
STANDOFF1  99.06,48.26 0 top
STANDOFF2  99.06,2.54 0 top
STANDOFF3  2.54,2.54 0 top
STANDOFF4  2.54,48.26 0 top
U1  54.61,41.91 0 top
U2  83.82,24.13 90 top
U$1  22.86,35.56 270 top

### Tracks (layer width: path | path; a pad name or v marks a point on that pad's centre or on a via)
3.3V  (via drill 0.51)
  Top 0.203: U$1.9 21.56,30.92 C17.1
  Top 0.254: C1.A 80.52,22.22 80.77,22.48 80.77,23.1 C2.1 80.95,23.18 U2.5 82.52,22.64 82.55,22.61 | R2.2 R3.2 | R4.2 R3.2 | R3.2 87.38,37.08 v87.63,36.83 | U$1.9 21.56,34.64 v21.59,34.67 | R10.2 59.05,31.75 58.61,32.2 U1.33 58.61,35.5 v59.18,36.07 | R6.2 v67.44,43.18 67.44,41.63 Q1.1 | Q2.1 73.98,39.69 v74.04,39.62 72.39,39.62 | 71.12,39.62 70.87,39.62 70.57,39.33 R1.2 | v71.12,43.18 71.12,39.62 | 71.12,39.62 72.39,39.62 | 72.39,39.62 v72.39,38.48
  Top 0.813: 82.55,22.61 82.55,20.32 v83.82,19.05
  Bottom 0.254: v87.63,36.83 87.63,29.72 87.12,29.21 JP11.5 JP11.3 JP11.1 74.93,29.21 | 74.93,29.21 74.93,20.95 75.56,20.32 82.55,20.32 v83.82,19.05 83.82,1.4 83.19,0.76 22.35,0.76 21.59,1.52 v21.59,34.67 | 74.93,29.21 72.39,29.21 | 72.39,29.21 61.34,29.21 60.58,29.97 60.58,34.67 v59.18,36.07 | v67.44,43.18 v71.12,43.18 | v72.39,38.48 72.39,29.21
  Bottom 0.813: v83.82,19.05 96.52,19.05 97.79,17.78 JP16.1 JP16.3 JP16.5 JP16.7
5V_CTS  (via drill 0.51)
  Top 0.254: R9.2 v67.31,38.1
  Bottom 0.254: JP1.CTS 64.77,38.73 65.41,38.1 v67.31,38.1 69.85,38.1 71.12,39.37 72.9,39.37 74.17,38.1 75.69,38.1 76.07,38.48 76.07,39.12 76.33,39.37 92.33,39.37 92.71,39.75 JP19.P$1
5V_RTS  (via drill 0.51)
  Top 0.254: v82.55,44.45 82.13,44.03 R7.1 76.37,44.03 76.12,44.28 Q2.3 v74.93,45.72
  Bottom 0.254: v82.55,44.45 JP19.P$5 | v74.93,45.72 JP1.DTR
5V_RX  (via drill 0.51)
  Top 0.254: R8.2 64.98,41.24 v65.66,41.91
  Bottom 0.254: JP1.RXI 72.39,42.04 72.52,41.91 | JP19.P$2 90.17,42.29 89.79,41.91 72.52,41.91 | 72.52,41.91 v65.66,41.91
5V_TX  (via drill 0.51)
  Top 0.203: v89.15,43.56 89.15,45.09 88.94,45.3 R5.1
  Top 0.254: Q1.3 69.68,45.85 | 69.68,45.85 69.68,47.45 69.85,47.62 JP1.TXO | v73.41,45.59 72.01,45.59 71.75,45.85 69.68,45.85
  Bottom 0.203: 87.63,43.81 88.9,43.81 v89.15,43.56
  Bottom 0.254: JP19.P$3 87.63,43.81 86.36,42.55 83.57,42.55 82.93,43.18 73.79,43.18 73.41,43.56 v73.41,45.59
!RESET  (via drill 0.51)
  Top 0.254: U1.44 61.53,41.21 v62.23,41.91 | v62.99,33.02 62.99,31.84 R10.1
  Bottom 0.254: v62.23,41.91 62.23,33.78 v62.99,33.02
AIO_1  (via drill 0.51)
  Top 0.203: U1.12 50.1,41.21 50.16,41.15 v50.16,40.39
  Bottom 0.203: JP15.1 36.83,43.18 37.34,42.67 39.37,42.67 40.13,41.91 50.04,41.91 50.16,41.78 v50.16,40.39
CAP_SENSE-4
  Top 0.203: JP10.3 40.64,42.29 41.02,41.91 46.1,41.91 46.48,42.29 46.48,43.18 47.71,44.41 U1.8
CAP_SENSE_1
  Top 0.203: JP10.4 43.18,43.18 43.69,42.67 45.09,42.67 47.62,45.21 U1.7
CAP_SENSE_2
  Top 0.203: JP10.1 35.56,43.18 36.45,42.29 38.99,42.29 40.39,40.89 47.37,40.89 47.62,41.15 47.62,42.55 47.89,42.81 U1.10
CAP_SENSE_3
  Top 0.203: JP10.2 38.1,43.18 38.35,42.93 38.99,42.93 40.51,41.4 46.99,41.4 47.12,41.53 47.12,43.05 47.67,43.61 U1.9
CHG_EXT
  Top 0.203: U1.29 55.41,31.84 56.05,31.2 Q3.1
CTS
  Top 0.254: R9.1 62.61,38.1 62.52,38.01 U1.40
GND  (via drill 0.51)
  Top 0.203: U$1.10 22.21,29.35 | 22.21,29.35 22.23,29.34 | C17.2 21.98,29.12 22.21,29.35
  Top 0.254: U2.2 85.98,24.13 86.23,24.38 86.23,24.89 86.36,25.02 C3.C
  Top 0.813: 17.78,1.27 21.59,1.27
  other vias: 41.91,38.1 41.91,36.83 41.91,35.56 41.91,34.29 16.51,12.7 16.51,19.05 22.86,6.35 20.32,6.35 20.32,5.08 24.13,7.62 24.13,8.89 19.05,3.81 19.05,5.08 19.05,6.35 25.4,8.89 15.24,12.7 15.24,11.43 16.51,11.43 16.51,7.62 15.24,7.62 15.24,6.35 16.51,6.35 15.24,19.05 15.24,22.86 16.51,22.86 62.23,46.99 64.77,31.75 66.04,31.75 67.31,31.75 68.58,31.75 63.5,46.99 66.04,46.99 71.12,22.86 72.39,22.86 73.66,22.86 71.12,19.05 72.39,19.05 73.66,19.05 80.01,46.99 81.28,46.99
  pour Bottom (isolate 0.305): 33.02,50.8 33.02,45.72 37.97,42.42 46.86,42.42 46.86,24.13 41.91,24.13 38.1,20.32 38.1,20.32 17.78,0 0,0 0,50.8
  pour Top (isolate 0.305): 33.02,50.8 33.02,45.72 37.97,42.42 46.86,42.42 46.86,33.15 46.74,24.13 41.91,24.13 17.78,0 0,0 0,50.8
  pour Bottom (isolate 0.305): 48.26,50.8 48.26,22.86 41.91,22.86 19.05,0 101.6,0 101.6,50.8
  pour Top (isolate 0.305): 48.26,50.8 48.26,22.86 41.91,22.86 19.05,0 101.6,0 101.6,50.8
L_OUT
  Top 0.203: R18.1 23.5,42.8 | U$1.3 23.46,41.48 C9.1 23.41,42.71 23.5,42.8 | 23.5,42.8 22.86,43.43 4.7,43.43 4.3,43.03 JP13.RING
LED_0  (via drill 0.51)
  Top 0.203: U1.37 76.89,35.61 77.09,35.81 v77.98,35.81 D2.C
  Bottom 0.203: v77.98,35.81 79.63,35.81 80.01,35.43 JP11.2
LED_1  (via drill 0.51)
  Top 0.203: U1.38 76.8,36.41 v77.47,37.08 D3.C
  Bottom 0.203: v77.47,37.08 82.17,37.08 82.55,36.7 JP11.4
LED_2  (via drill 0.51)
  Top 0.203: U1.39 75.82,37.21 v76.96,38.35 D1.C
  Bottom 0.203: v76.96,38.35 84.84,38.35 85.09,38.1 JP11.6
MIC_BIAS_A  (via drill 0.51)
  Top 0.203: U1.17 47.5,37.21 45.21,34.92 45.21,28.83 44.45,28.07 30.99,28.07 30.48,27.56 30.48,22.86 | 30.48,22.86 30.48,18.41 30.13,18.07 S7.4 24.09,17.31 24.77,16.64 24.77,13.84 24.09,13.17 S7.1 | 30.48,22.86 v25.4,22.86
  Bottom 0.203: v25.4,22.86 25.4,40.64 20.32,45.72 20.32,48.26 JP17.2
MIC_LN  (via drill 0.51)
  Top 0.203: U1.20 47.38,34.81 46.99,34.42 46.99,28.32 44.7,26.04 33.66,26.04 33.02,25.4 v33.02,24.13 | 21.63,8 R26.2 | R26.2 C19.1 L2.2 | v33.02,21.59 33.02,18.54 31.11,16.64 26.42,16.64 26.04,16.26 26.04,11.05 25.15,10.16 23.11,10.16 22.73,9.78 22.73,8.38 22.39,8.04 R26.2
  Bottom 0.203: v33.02,24.13 33.02,22.73 | 33.02,22.73 v33.02,21.59 | JP17.4 22.86,48.26 22.86,45.72 27.3,41.27 27.3,23.5 27.94,22.86 32.89,22.86 33.02,22.73
MIC_LP  (via drill 0.51)
  Top 0.203: U1.21 47.73,34.01 47.5,33.78 47.5,28.07 44.7,25.27 34.16,25.27 34.04,25.15 34.04,23.88 v31.75,21.59 31.75,18.16 30.86,17.27 25.78,17.27 25.4,16.89 25.4,11.43 25.02,11.05 21.59,11.05 | S7.2 21.59,11.05 | 21.59,11.05 R26.1
  Bottom 0.203: v31.75,21.59 30.99,21.59 30.35,22.23 27.81,22.23 26.67,23.37 26.67,40.64 21.59,45.72 JP17.3
MIC_RN  (via drill 0.51)
  Top 0.203: U1.18 47.46,36.41 45.97,34.92 45.97,28.83 44.7,27.56 32.38,27.56 v32,27.18 | v29.21,25.4 22.23,25.4 21.59,24.77 R25.2 C18.1 L1.2
  Bottom 0.203: v32,27.18 29.21,27.18 | v29.21,25.4 29.21,27.18 | 29.21,27.18 29.21,44.07 28.83,44.45 26.8,44.45 25.4,46.1 25.4,48.26 JP17.6
MIC_RP  (via drill 0.51)
  Top 0.203: U1.19 47.42,35.61 46.48,34.67 46.48,28.57 44.7,26.8 33.02,26.8 v32,25.78 | v29.21,24.13 23.11,24.13 22.86,23.88 22.86,21.08 22.52,20.74 R25.1 S7.5
  Bottom 0.203: v32,25.78 32,24.64 31.5,24.13 v29.21,24.13 28.32,24.13 27.94,24.51 27.94,41.91 24.13,45.72 JP17.5
N$1
  Top 0.254: L3.2 4.57,10.16 4.32,10.41 4.32,11.43 3.96,11.79 JP14.SLEEVE
N$2
  Top 0.203: D3.A R3.1
N$4
  Top 0.203: C8.2 R16.2
N$5
  Top 0.203: C6.2 R13.2
N$6
  Top 0.203: D2.A R4.1
N$7
  Top 0.203: D1.A R2.1
N$8
  Top 0.203: R13.1 29.25,41.53 C5.1 29.17,41.53 | R15.2 29.17,41.53 | R18.2 29.17,41.53
N$9
  Top 0.203: R15.1 C9.2 25.11,40.85 24.77,40.51 24.38,40.51 24.11,40.24 U$1.2
N$12
  Top 0.203: U$1.1 24.76,39.49 25.02,39.75 R17.1 26.29,39.71 C7.1
N$13
  Top 0.203: R16.1 29.25,39.75 C5.2 | C5.2 28.07,39.79 R17.2 | R14.1 C5.2
N$15
  Top 0.203: 11.68,11.81 JP14.TIP 11.72,11.81 13.34,11.81 13.59,12.06 13.59,20.07 14.26,20.74 L1.1
N$16
  Top 0.203: R21.2 29.17,31.37 C10.1 | R20.2 C10.1 | R19.1 29.25,31.37 C10.1
N$17
  Top 0.203: C12.2 26.29,31.41 R21.1 25.02,31.37 24.81,31.58 U$1.14
N$18
  Top 0.203: C11.2 R19.2
N$19
  Top 0.203: R22.1 29.25,29.59 C10.2 29.17,29.59 | R24.2 29.17,29.59 | R23.2 29.17,29.59
N$20
  Top 0.203: C13.2 R22.2
N$21
  Top 0.203: R23.1 C14.2 25.11,30.27 24.77,30.61 24.38,30.61 24.16,30.83 U$1.13
N$22
  Top 0.203: L2.1 9.44,9.74 8.89,10.29 8.89,18.29 8.51,18.67 4.32,18.67 JP14.RING
N$24
  Top 0.203: U$1.6 21.51,40.25 C16.1
N$25
  Top 0.203: U$1.7 19.56,38.36 19.3,38.1 C15.2
N$26
  Top 0.203: U$1.8 19.56,32.76 19.3,33.02 C15.1
N$28
  Top 0.203: R12.1 64.91,27.74 C4.1
PCM_CLK/CLK  (via drill 0.51)
  Top 0.254: U1.47 62.44,43.61 v62.48,43.56
  Bottom 0.254: JP12.2 64.77,19.05 64.77,22.48 64.39,22.86 60.07,22.86 59.69,23.24 59.69,33.53 58.29,34.92 58.29,41.02 59.18,41.91 59.18,43.31 59.44,43.56 v62.48,43.56
PCM_IN/MOSI  (via drill 0.51)
  Top 0.254: U1.49 57.15,45.21 v57.02,45.21
  Bottom 0.254: JP12.4 59.69,19.05 58.93,19.05 58.42,19.56 58.42,33.02 57.02,34.42 v57.02,45.21
PCM_OUT/MISO  (via drill 0.51)
  Top 0.254: U1.48 57.62,44.41 57.53,44.32 56.64,44.32 56.52,44.45 v55.88,44.45
  Bottom 0.254: JP12.5 57.15,19.05 57.15,33.02 55.88,34.29 v55.88,44.45
PCM_SYNC/CSB  (via drill 0.51)
  Top 0.254: U1.46 58.3,42.81 v58.29,42.8
  Bottom 0.254: JP12.3 62.23,19.05 60.71,19.05 60.07,19.68 59.31,19.68 59.05,19.94 59.05,33.15 57.66,34.54 57.66,42.16 v58.29,42.8
PIO_0
  Top 0.203: U1.23 50.61,14.16 50.16,13.72 44.83,13.72 44.45,13.34 JP4.2
  Top 0.254: JP4.2 44.45,7.24 44.7,6.99 S2.2
PIO_1
  Top 0.203: U1.24 51.41,10.82 52.07,10.16 JP5.2
  Top 0.254: JP5.2 52.07,7.37 52.45,6.99 S3.2
PIO_2  (via drill 0.51)
  Top 0.203: U1.50 57.62,46.01 57.53,46.1 56.26,46.1 v54.61,44.45
  Top 0.254: JP7.2 69.85,7.24 70.1,6.99 S4.2
  Bottom 0.203: v54.61,44.45 54.61,43.31 53.47,42.16 53.47,39.62 53.21,39.37 50.16,39.37 49.53,38.73 49.53,16.38 50.04,15.88 52.45,15.88 52.83,16.26 61.72,16.26 63.25,14.73 63.25,11.3 64.26,10.29 69.72,10.29 69.85,10.16 JP7.2
PIO_3  (via drill 0.51)
  Top 0.203: U1.51 55.32,46.81 v54.61,46.1
  Bottom 0.203: v54.61,46.1 53.85,46.1 53.59,45.85 53.59,43.81 52.45,42.67 41.15,42.67 JP15.2
PIO_4  (via drill 0.51)
  Top 0.203: U1.26 53.01,15.57 v53.34,15.24
  Top 0.254: JP8.2 62.23,7.24 62.48,6.99 S5.2
  Bottom 0.203: JP8.2 62.23,14.61 61.59,15.24 v53.34,15.24
PIO_5
  Top 0.203: U1.25 52.21,13.2 52.7,12.7 76.96,12.7 77.47,12.19 JP9.2
  Top 0.254: JP9.2 77.47,7.24 77.72,6.99 S6.2
PIO_6
  Top 0.203: U1.5 46.56,46.81 46.23,46.48 46.23,44.83 45.85,44.45 JP15.4
PIO_7  (via drill 0.51)
  Top 0.203: U1.6 50.51,46.01 v50.8,45.72
  Bottom 0.203: v50.8,45.72 43.18,45.72 JP15.3
R_OUT
  Top 0.203: U$1.12 23.51,29.69 C14.1 23.41,28.41 23.5,28.32 | R24.1 23.5,28.32 | 23.5,28.32 23.37,28.32 22.86,27.81 12.06,27.81 11.68,28.19 11.68,32.09 JP13.TIP
RTS  (via drill 0.51)
  Top 0.254: U1.43 62,40.41 62.61,41.02 63.5,41.02 63.92,41.44 R6.1 63.92,44.49 64.14,44.7 v68.58,44.7 | v71.12,44.7 73.41,44.7 73.66,44.45 73.66,43.56 74.04,43.18 75.69,43.18 75.88,42.99 Q2.2
  Bottom 0.254: v68.58,44.7 v71.12,44.7
RX
  Top 0.254: U1.42 62.09,39.61 62.48,40.01 R8.1
SPI_!PCM  (via drill 0.51)
  Top 0.254: U1.45 58.9,42.01 58.8,41.91 57.91,41.91 57.78,42.04 54.74,42.04 v54.61,41.91
  Bottom 0.254: JP12.6 55.88,33.02 54.61,34.29 v54.61,41.91
SPKR_LN
  Top 0.203: U1.13 40.11,40.41 38.99,41.53 C6.1 35.14,42.84 34.8,43.18 33.4,43.18 33.02,43.56 33.02,48.26 31.75,49.53 JP17.10
SPKR_LP  (via drill 0.51)
  Top 0.203: U1.14 39.13,39.61 38.99,39.75 C8.1 35.14,37.93 v34.92,37.72
  Bottom 0.203: JP17.9 34.29,46.99 34.92,46.35 v34.92,37.72
SPKR_RN  (via drill 0.51)
  Top 0.203: C13.1 v36.83,29.59 | v36.83,33.02 42.8,33.02 43.18,33.4 43.18,38.23 43.76,38.81 U1.15
  Bottom 0.203: v36.83,29.59 v36.83,33.02 34.42,33.02 34.04,33.4 34.04,45.09 33.66,45.47 28.19,45.47 27.94,45.72 27.94,48.26 JP17.8
SPKR_RP  (via drill 0.51)
  Top 0.203: U1.16 44.61,38.01 44.07,37.47 44.07,32 43.43,31.37 C11.1 35.14,32.42 34.54,33.02 v33.02,33.02 | JP17.7 27.94,45.72 31.88,45.72 32.26,45.34 v32.26,42.93
  Bottom 0.203: v32.26,42.93 33.4,41.78 33.4,33.4 v33.02,33.02
TX
  Top 0.254: U1.41 62.94,38.81 63.25,39.12 65.79,39.12 66.36,39.69 Q1.2 68.51,39.69 68.87,39.33 R1.1
USB_N
  Top 0.203: U1.35 93.1,34.01 94,34.91 JP2.D-
USB_P
  Top 0.203: U1.36 93.32,34.81 94.07,35.56 JP2.D+
V_BAT
  Top 0.203: U1.32 57.81,31.98 59.31,30.48 61.72,30.48 61.85,30.35 61.85,29.22 R11.1 R12.2
  Top 0.813: R11.1 61.86,21.07 62.61,20.32 78.74,20.32 81.92,17.14 90.55,17.14 91.06,17.65 D4.A 93.22,19.05 94.09,19.92 JP6.2
V_FTDI  (via drill 0.51)
  Top 0.813: v71.12,46.99 77.47,46.99 78.74,45.72 83.44,45.72 83.82,45.34 D5.A v85.09,43.69
  Bottom 0.813: JP1.VCC 67.31,47.5 67.82,46.99 v71.12,46.99 | v85.09,43.69 JP19.P$4
V_USB
  Top 0.254: JP2.VBUS 95.09,34.26 94.87,33.91
  Top 0.813: 94.87,33.91 94.87,30.73 94.61,30.48 D6.A
VBAT_SENSE
  Top 0.203: U1.31 57.01,32.14 58.25,30.9 Q3.3 R11.2
VIN  (via drill 0.51)
  Top 0.203: U1.30 56.21,32.18 57.15,31.24 57.15,28.45 56.96,28.26 Q3.2
  Top 0.254: U2.3 84.01,25.08 83.82,24.89 83.82,23.37 84.01,23.18 U2.1 | R7.2 84.67,42.33 85.09,41.91 D5.C | R5.2 87.63,41.03
  Top 0.406: U2.1 85.12,22.58 85.47,22.23 C3.A
  Top 0.813: D4.C 86.74,20.32 87.38,20.95 C3.A 89.79,22.23 90.17,22.61 90.17,27.3 v89.34,28.13 89.29,28.18 D6.C | D5.C 87.63,41.03 88.64,41.03 89.28,40.39 v89.28,36.83 | Q3.2 56.05,22.05 56.52,21.59 v60.33,21.59 | v63.5,21.59 v76.2,21.59
  Bottom 0.813: v89.28,36.83 89.28,28.19 v89.34,28.13 90.11,27.37 90.11,22.54 89.15,21.59 v76.2,21.59 | v60.33,21.59 v63.5,21.59
VREGEN  (via drill 0.51)
  Top 0.203: U1.28 54.61,14.35 54.23,13.97 v53.34,13.97
  Top 0.254: JP3.2 34.29,7.24 34.54,6.99 S1.2
  Bottom 0.203: v53.34,13.97 34.67,13.97 34.29,13.59 JP3.2

### Text on the board
tPlace: MIC_BIAS_A | N | 2 | 3 | 4 | 1 | CAP SENSE | GND | P | GND | CTS | VIN | TXO | RXI | DTR | SERIAL->MICRO | FTDI->PC | L | R | L | R | MIC | SPKR | AIO_1 | PIO_3 | PIO_7 | PIO_6 | Headphone/ / Line Out | LED2 | LED1 | LED0 | LED1 | LED0 | LED2 | MIC in/ / LINE in | SPI/!PCM | PCM_OUT / MISO | PCM_IN / MOSI | PCM_SYNC / CSB | PCM_CLK / CLK | GND | 3.3V | GND | MIC in | LINE in | PURPLETOOTH JAMBOT!! | PAIR | VOL- | VOL+